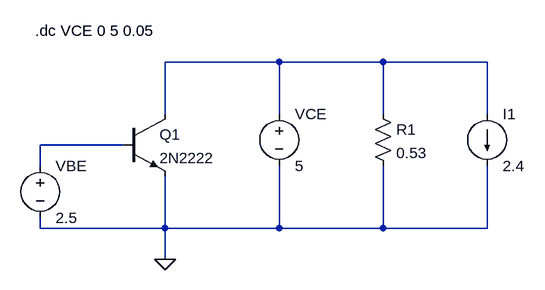
[diagram p0: schematic npn_Ic_2.asc]
npn_Ic_2.asc, the LTspice schematic file:
Version 4
SHEET 1 880 776
WIRE 432 32 256 32
WIRE 592 32 432 32
WIRE 752 32 592 32
WIRE 256 112 256 32
WIRE 432 112 432 32
WIRE 592 112 592 32
WIRE 752 112 752 32
WIRE 192 160 64 160
WIRE 64 192 64 160
WIRE 64 288 64 272
WIRE 256 288 256 208
WIRE 256 288 64 288
WIRE 432 288 432 192
WIRE 432 288 256 288
WIRE 592 288 592 192
WIRE 592 288 432 288
WIRE 752 288 752 192
WIRE 752 288 592 288
WIRE 256 336 256 288
FLAG 256 336 0
SYMBOL npn 192 112 R0
SYMATTR InstName Q1
SYMATTR Value 2N2222
SYMBOL voltage 64 176 R0
WINDOW 123 0 0 Left 0
WINDOW 39 0 0 Left 0
SYMATTR InstName VBE
SYMATTR Value 2.5
SYMBOL voltage 432 96 R0
WINDOW 123 0 0 Left 0
WINDOW 39 0 0 Left 0
SYMATTR InstName VCE
SYMATTR Value 5
SYMBOL res 576 96 R0
SYMATTR InstName R1
SYMATTR Value 0.53
SYMBOL current 752 112 R0
WINDOW 123 0 0 Left 0
WINDOW 39 0 0 Left 0
SYMATTR InstName I1
SYMATTR Value 2.4
TEXT 56 -16 Left 2 !.dc VCE 0 5 0.05

The netlist it stands for:
* npn_Ic_2.asc
Q1 N001 N002 0 0 2N2222
VBE N002 0 2.5
VCE N001 0 5
R1 N001 0 0.53
I1 N001 0 2.4
.model NPN NPN
.model PNP PNP
.lib standard.bjt
.dc VCE 0 5 0.05
.backanno
.end